# EAGLE schematic PowerSystemOverview (EAGLE 9.3.0)
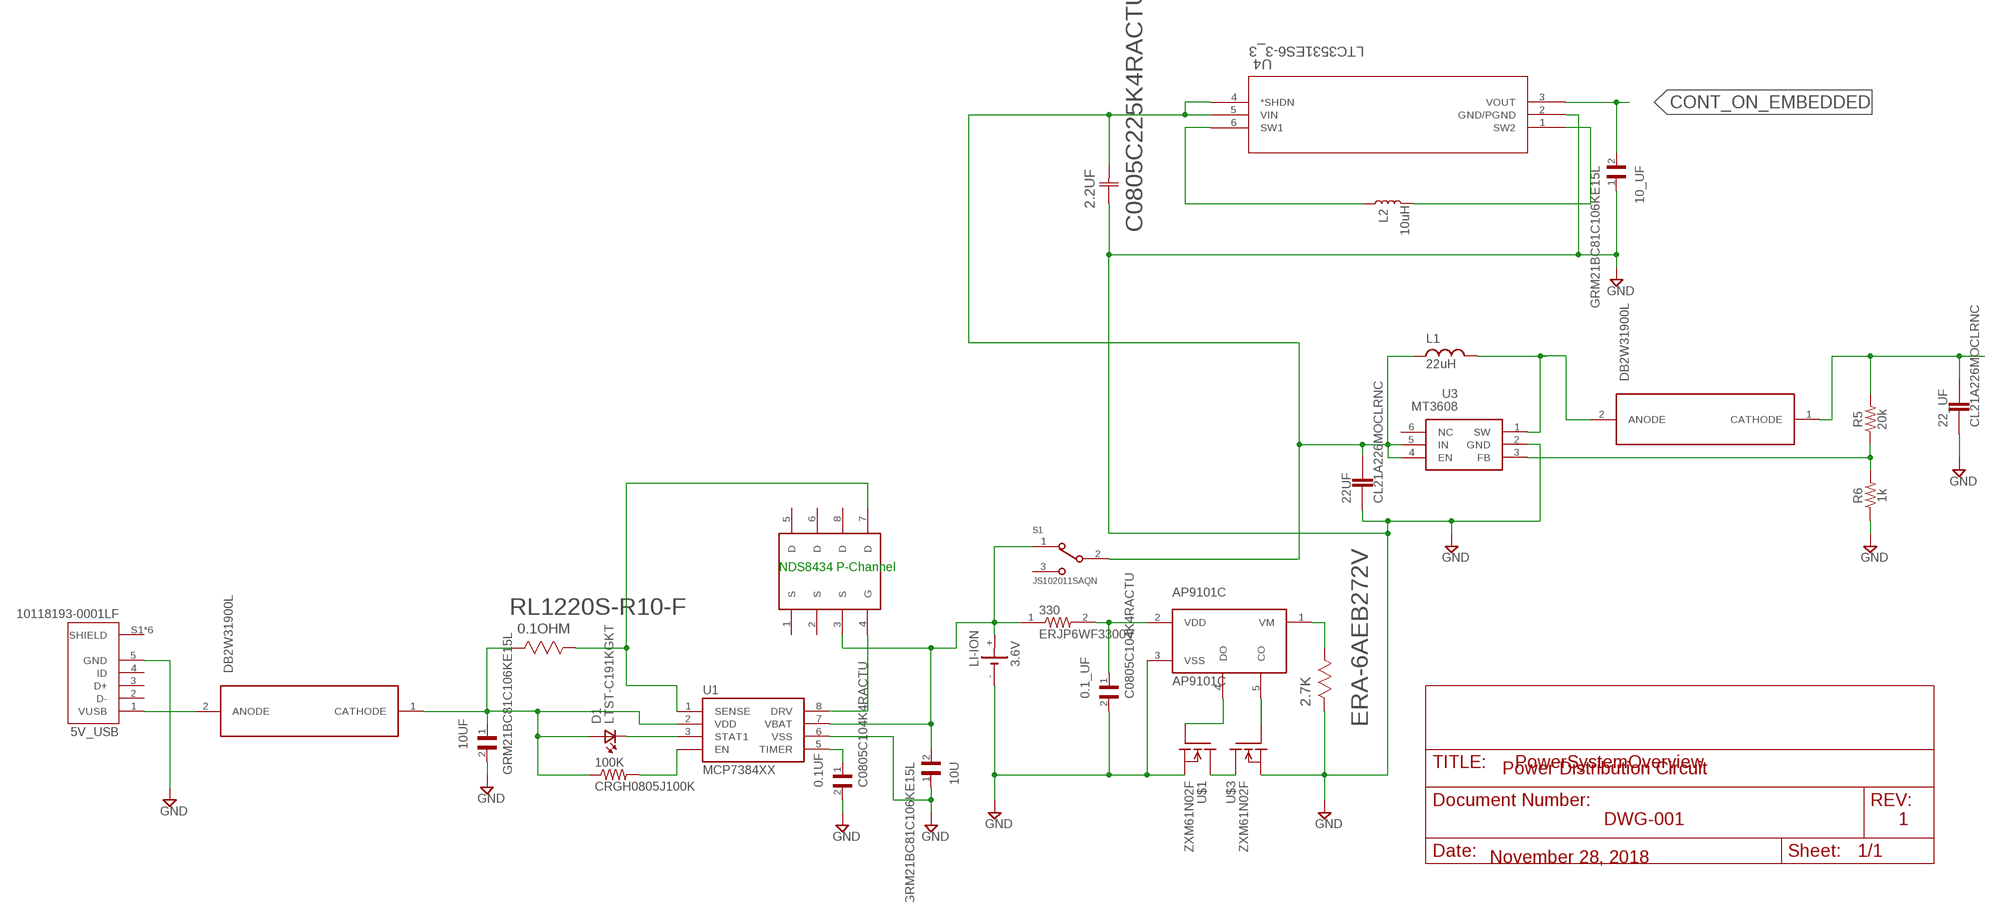
[diagram p0: schematic, sheet 1]

## Parts
0.1_UF  C0805C104K4RACTU  [CAPC2012X88N]
0.1OHM  RL1220S-R10-F  [RESC2013X65N]
0.1UF  C0805C104K4RACTU  [CAPC2012X88N]
2.2UF  C0805C225K4RACTU  [CAPC2013X140N]
2.7K  ERA-6AEB272V  [RESC2013X65N]
5V_USB  10118193-0001LF  [FCI_10118193-0001LF]
10_UF  GRM21BC81C106KE15L  [CAPC2012X135N]
10U  GRM21BC81C106KE15L  [CAPC2012X135N]
10UF  GRM21BC81C106KE15L  [CAPC2012X135N]
22_UF  CL21A226MOCLRNC  [CAPC2012X140N]
22UF  CL21A226MOCLRNC  [CAPC2012X140N]
100K  CRGH0805J100K  [RESC2012X65N]
330  ERJP6WF3300V  [RESC2012X70]
D1  LTST-C191KGKT  [0603]
L1  22uH  L  (no package)
L2  10uH  INDUCTORINDUCTOR_10UH  [INDUCTOR_3X3]
LI-ION  3.6V  SL-160AA/PR  [SL-160AA/PR]
R5  20k  20KOHM-0603-1/10W-1%  [0603]
R6  1k  1KOHM-0603-1/10W-1%  [0603]
S1  JS102011SAQN  [SW_JS102011SAQN]
U1  MCP7384XX  [MSOP8]
U3  MT3608  [SOT95P280X145-6N]
U4  LTC3531ES6-3_3  [TSOT-23_S6]
U$1  ZXM61N02F  [SOT23W]
U$2  NDS8434  [SO08]
U$3  ZXM61N02F  [SOT23W]
U$4  AP9101C  [SOT23-5]
U$5  DB2W31900  [SOT-23-5]
U$6  DB2W31900  [SOT-23-5]

## Nets
CONT_ON_EMBEDDED: 10_UF.2 U4.3(VOUT)
GND: 0.1_UF.2 0.1UF.2 2.2UF.1(C1) 2.7K.2(R2) 5V_USB.5(GND) 10_UF.1 10U.1 10UF.2 22_UF.1 22UF.1 LI-ION.- R6.1 U1.6(VSS) U3.2(GND) U4.2(GND/PGND) U$1.2(S) U$3.2(S) U$4.3(VSS)
N$1: 0.1OHM.1(R1) U1.1(SENSE) U$2.7(D)
N$2: U1.8(DRV) U$2.4(G)
N$3: 0.1OHM.2(R2) 10UF.1 100K.1 D1.2(A2) U1.2(VDD) U$5.1(CATHODE)
N$4: 100K.2 U1.4(EN)
N$5: D1.1(K2) U1.3(STAT1)
N$6: 0.1UF.1 U1.5(TIMER)
N$7: 0.1_UF.1 330.2 U$4.2(VDD)
N$8: U$1.3(D) U$3.3(D)
N$9: 2.7K.1(R1) U$4.1(VM)
N$10: U$1.1(G) U$4.4(DO)
N$11: U$3.1(G) U$4.5(CO)
N$12: 5V_USB.1(VUSB) U$5.2(ANODE)
N$13: R5.1 R6.2 U3.3(FB)
N$14: L2.P$1 U4.6(SW1)
N$15: L2.P$2 U4.1(SW2)
N$16: 2.2UF.2(C2) 22UF.2 L1.1 S1.2 U3.4(EN) U3.5(IN) U4.4(*SHDN) U4.5(VIN)
N$17: 22_UF.2 R5.2 U$6.1(CATHODE)
N$18: L1.2 U3.1(SW) U$6.2(ANODE)
N$19: 10U.2 330.1 LI-ION.+ S1.1 U1.7(VBAT) U$2.3(S)
Unconnected: 5V_USB.2(D-) 5V_USB.3(D+) 5V_USB.4(ID) 5V_USB.S1(SHIELD) 5V_USB.S2(SHIELD) 5V_USB.S3(SHIELD) 5V_USB.S4(SHIELD) 5V_USB.S5(SHIELD) 5V_USB.S6(SHIELD) S1.3 U3.6(NC) U$2.1(S) U$2.2(S) U$2.5(D) U$2.6(D) U$2.8(D)

## Notes on the sheet
- NDS8434 P-Channel
- Power Distribution Circuit
- DWG-001 | 1
- November 28, 2018

## Library data of the parts
0.1_UF 0.1UF = C0805C104K4RACTU:C0805C104K4RACTU: Ceramic Multilayer Capacitor; Capacitor Type:General Purpose; Capacitance:0.01µF; Capacitance Tolerance:± 10%; Voltage Rating:16V; Capacitor Dielectric Type:Multilayer Ceramic; Package/Case:0805; Termination Type:SMD ;RoHS Compliant: Yes; DESCRIPTION: Capacitor; Ceramic; Cap; .100uf ; Tol+10%; Smd; Vol-Rtg 16v; X7r; DIGI-KEY_PART_NUMBER: 399-1167-1-ND; DIGI-KEY_PURCHASE_URL: https://www.digikey.com/product-detail/en/kemet/C0805C104K4RACTU/399-1167-1-ND/411442?utm_source=snapeda&utm_medium=aggregator&utm_campaign=symbol; MF: KEMET; MP: C0805C104K4RACTU; PACKAGE: 0805 Kemet
0.1OHM = RL1220S-R10-F:RL1220S-R10-F: RESISTOR, 0805; DESCRIPTION: Res Thin Film 0805 0.1 Ohm 1% 0.33W_1/3W_ 0ppm/C to 200ppm/C Pad SMD Automotive T/R; DIGI-KEY_PART_NUMBER: RL12S.10FCT-ND; DIGI-KEY_PURCHASE_URL: https://www.digikey.com/product-detail/en/susumu/RL1220S-R10-F/RL12S.10FCT-ND/433019?utm_source=snapeda&utm_medium=aggregator&utm_campaign=symbol; MF: Susumu; MP: RL1220S-R10-F; PACKAGE: 0805 Susumu
2.2UF = C0805C225K4RACTU:C0805C225K4RACTU: CAPACITOR, 0805; DESCRIPTION: Capacitor; Ceramic; Cap; 2.20uf ; Tol+10%; Smd; Vol-Rtg 16v; High Cap. ; X7r; DIGI-KEY_PART_NUMBER: 399-3523-1-ND; DIGI-KEY_PURCHASE_URL: https://www.digikey.com/product-detail/en/kemet/C0805C225K4RACTU/399-3523-1-ND/789663?utm_source=snapeda&utm_medium=aggregator&utm_campaign=symbol; MF: KEMET; MP: C0805C225K4RACTU; PACKAGE: 0805 KEMET
2.7K = ERA-6AEB272V:ERA-6AEB272V: RESISTOR, 0805; DESCRIPTION: Res Thin Film 0805 2.7K Ohm 0.1% 0.125W_1/8W_ Ø¢Â±25ppm/Ø¢Â°C Molded SMD Automotive Punched T/R; DIGI-KEY_PART_NUMBER: P2.7KDACT-ND; DIGI-KEY_PURCHASE_URL: https://www.digikey.com/product-detail/en/panasonic-electronic-components/ERA-6AEB272V/P2.7KDACT-ND/1465957?utm_source=snapeda&utm_medium=aggregator&utm_campaign=symbol; MF: Panasonic; MP: ERA-6AEB272V; PACKAGE: 0805 Panasonic
5V_USB = 10118193-0001LF:10118193-0001LF: Micro USB B Type Receptacle; DESCRIPTION: Single Port 5 Contact Shielded SMT MICRO USB B-Type Receptacle; DIGI-KEY_PART_NUMBER: 609-4616-1-ND; DIGI-KEY_PURCHASE_URL: https://www.digikey.com/product-detail/en/amphenol-icc-fci/10118193-0001LF/609-4616-1-ND/2785380?utm_source=snapeda&utm_medium=aggregator&utm_campaign=symbol; MF: Amphenol ICC; MP: 10118193-0001LF; PACKAGE: None
10_UF 10U 10UF = GRM21BC81C106KE15L:GRM21BC81C106KE15L: Cap Ceramic 10uF 16V X6S 10% SMD 0805 105C T/R; DESCRIPTION: 0805 10 uF 16V ±10% Tolerance X6S SMT Multilayer Ceramic Capacitor; DIGI-KEY_PART_NUMBER: 490-10498-1-ND; DIGI-KEY_PURCHASE_URL: https://www.digikey.com/product-detail/en/murata-electronics-north-america/GRM21BC81C106KE15L/490-10498-1-ND/5026423?utm_source=snapeda&utm_medium=aggregator&utm_campaign=symbol; MF: Murata; MP: GRM21BC81C106KE15L; PACKAGE: 0805 Murata
22_UF 22UF = CL21A226MOCLRNC:CL21A226MOCLRNC: 22µF ±20% 25V Ceramic Capacitor X5R 0805 (2012 Metric); DESCRIPTION: Cap Ceramic 22uF 16V X5R 20% SMD 0805 85°C Cardboard T/R; DIGI-KEY_PART_NUMBER: 1276-6780-1-ND; DIGI-KEY_PURCHASE_URL: https://www.digikey.com/product-detail/en/samsung-electro-mechanics/CL21A226MOCLRNC/1276-6780-1-ND/5961639?utm_source=snapeda&utm_medium=aggregator&utm_campaign=symbol; MF: Samsung Electro-Mechanics; MP: CL21A226MOCLRNC; PACKAGE: 0805 Samsung
100K = CRGH0805J100K:CRGH0805J100K: CRGH Series Resistor 0805 5% 100K 0.33W; AVAILABILITY: Unavailable; COMMENT: 2-1879496-3; DESCRIPTION: CRGH0805 5% 100K 0.33W; EU_ROHS_COMPLIANCE: Compliant with Exemptions; MF: TE Connectivity; MP: CRGH0805J100K; PACKAGE: 0805; POWER_RATING: .33 W; PRICE: None; RESISTANCE: 100K; TE_PURCHASE_URL: https://www.te.com/usa-en/product-2-1879496-3.html?te_bu=Cor&te_type=disp&te_campaign=seda_glo_cor-seda-global-disp-prtnr-fy19-seda-model-bom-cta_sma-317_1&elqCampaignId=32493; TOLERANCE: 5%; VOLTAGE_RATING: 150 V
330 = ERJP6WF3300V:ERJP6WF3300V: RES, THICK FILM, 330R, 1%, 0.5W, 0805, REEL; AVAILABILITY: Unavailable; DESCRIPTION: ERJ Series 0805 330 Ohm ±1% 0.5 W ±200 ppm/°C 2-Side Thick Film Chip Resistor; MF: Panasonic; MP: ERJP6WF3300V; PACKAGE: 0805 Panasonic; PRICE: None
D1 = LTST-C191KGKT:LTST-C191KGKT: http://octopart.com/ltst-c190krkt-lite-on-549893; DESCRIPTION: Green 1.6 x 0.8 x 0.55 mm 130º Water Clear 35 mcd Surface Mount LED; DIGI-KEY_PART_NUMBER: 160-1446-1-ND; DIGI-KEY_PURCHASE_URL: https://www.digikey.com/product-detail/en/lite-on-inc/LTST-C191KGKT/160-1446-1-ND/386834?utm_source=snapeda&utm_medium=aggregator&utm_campaign=symbol; MF: Lite-On Inc.; MP: LTST-C191KGKT; PACKAGE: 0603 Lite-On
L1 = ngspice-simulation:L: INDUCTOR
L2 = SparkFun-Coils:INDUCTOR: Inductors Resist changes in electrical current. Basically a coil of wire. SparkFun Products: SparkFun Load Cell Amplifier - HX711 <https://www.sparkfun.com/products/13879> IOIO-OTG - V2.2 <https://www.sparkfun.com/products/13613>; PROD_ID: NDUC-13913
LI-ION = battery:SL-160AA/PR: LI BATTERY Sonnenschein
R5 = SparkFun-Resistors:20KOHM: 20kΩ resistor A resistor is a passive two-terminal electrical component that implements electrical resistance as a circuit element. Resistors act to reduce current flow, and, at the same time, act to lower voltage levels within circuits. - Wikipedia; PROD_ID: RES-09383
R6 = SparkFun-Resistors:1KOHM: 1kΩ resistor A resistor is a passive two-terminal electrical component that implements electrical resistance as a circuit element. Resistors act to reduce current flow, and, at the same time, act to lower voltage levels within circuits. - Wikipedia; PROD_ID: RES-07856
S1 = JS102011SAQN:JS102011SAQN: JS10 Series SPDT On-On 6 V 0.3 A Gull Wing SMT Slide Switch http://www.snapeda.com/parts/JS102011SAQN/C%26K%20Components/view-part/; DESCRIPTION: JS10 Series SPDT On-On 6 V 0.3 A Gull Wing SMT Slide Switch; DIGI-KEY_PART_NUMBER: 401-1999-1-ND; DIGI-KEY_PURCHASE_URL: https://www.digikey.com/product-detail/en/c-k/JS102011SAQN/401-1999-1-ND/1640114?utm_source=snapeda&utm_medium=aggregator&utm_campaign=symbol; MF: C&K; MP: JS102011SAQN; PACKAGE: None
U1 = SparkFun-IC-Power:MCP7384XX: Li-Ion charge controller family from Microchip (IC-08344)
U3 = MT3608:MT3608: High Efficiency 1.2MHz 2A Step Up Converter Source: Datasheet <https://www.olimex.com/Products/Breadboarding/BB-PWR-3608/resources/MT3608.pdf>; ARROW_PART_NUMBER: MT3608; DESCRIPTION: High Efficiency 1.2MHz 2A Step Up Converter; HEIGHT: 1.45mm; MANUFACTURER_NAME: Aerosemi; MANUFACTURER_PART_NUMBER: MT3608
U4 = LTC3531ES6-3_3:LTC3531ES6-3_3; AVAILABILITY: Unavailable; DESCRIPTION: LTC3531 - 200mA Buck-Boost Synchronous DC/DC Converters; MF: Linear Technology; MP: LTC3531ES6-3.3; PACKAGE: None; PRICE: None
U$1 U$3 = ZXM61N02F:ZXM61N02F: N-Ch Enhancement MOSFET, Logic Level (SOT23); AVAILABILITY: Unavailable; DESCRIPTION: N CHANNEL MOSFET, 20V, 1.7A, SOT-23; Transistor Polarity: N Channel; Continuous Drain Current Id: 1.7A; Drain Source ...; MF: Diodes Inc.; MP: ZXM61N02F; PACKAGE: SOT-23-3 Diodes Inc.; PRICE: None
U$2 = NDS8434:NDS8434: 8-SOIC NMOSFET; AVAILABILITY: Unavailable; DESCRIPTION: P-Channel 20 V 0.035 Ohm Surface Mount Field Effect Transistor - SOIC-8; MF: ON Semiconductor; MP: NDS8434; PACKAGE: SO-8 ON Semiconductor; PRICE: None
U$4 = AP910C:AP9101C: AP9101CAK-ABTRG1 Protection IC Chip The AP9101C is a protection IC designed with high precision voltage detection circuit. The AP9101C provides a function to protect batteries by detecting overcharge voltage, overdischarge voltage, overcharge current, overdischarge current and other abnormalities and turning off the external MOSFET switch. The AP9101C also has a built-in fixed time circuit (external capacitors are unnecessary), the protection circuitry can be comprised with fewer external components.
U$5 U$6 = DB2W31900L:DB2W31900: DB2W31900: - Low forward voltage VF - Low terminal capacitance Ct - Halogen-free / RoHS compliant (EU RoHS / UL-94 V-0 / MSL:Level 1 compliant) - Reverse Voltage : 30V - Forward Current: 3A